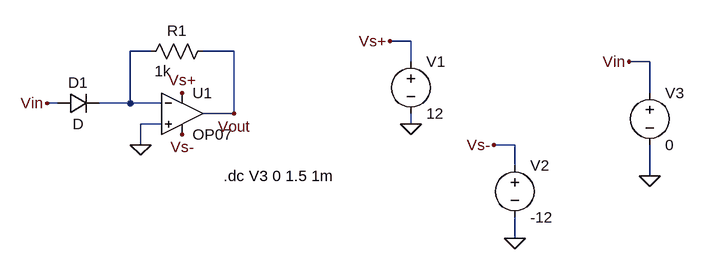
[diagram p0: schematic Task05 expo.asc]
Task05 expo.asc, the LTspice schematic file:
Version 4
SHEET 1 880 680
WIRE 192 -16 160 -16
WIRE -208 0 -240 0
WIRE -80 0 -128 0
WIRE 192 16 192 -16
WIRE 560 16 528 16
WIRE 560 64 560 16
WIRE -352 80 -368 80
WIRE -240 80 -240 0
WIRE -240 80 -288 80
WIRE -192 80 -240 80
WIRE -80 96 -80 0
WIRE -80 96 -128 96
WIRE -192 112 -224 112
WIRE 192 112 192 96
WIRE -224 144 -224 112
WIRE 352 144 320 144
WIRE 352 176 352 144
WIRE 560 192 560 144
WIRE 352 288 352 256
FLAG -224 144 0
FLAG -368 80 Vin
FLAG -160 64 Vs+
FLAG -160 128 Vs-
FLAG 192 112 0
FLAG 352 288 0
FLAG 160 -16 Vs+
FLAG 528 16 Vin
FLAG 320 144 Vs-
FLAG -80 96 Vout
FLAG 560 192 0
SYMBOL OpAmps\\OP07 -160 32 R0
SYMATTR InstName U1
SYMBOL voltage 192 0 R0
SYMATTR InstName V1
SYMATTR Value 12
SYMBOL voltage 352 160 R0
SYMATTR InstName V2
SYMATTR Value -12
SYMBOL voltage 560 48 R0
SYMATTR InstName V3
SYMATTR Value 0
SYMBOL diode -352 96 R270
WINDOW 0 32 32 VTop 2
WINDOW 3 0 32 VBottom 2
SYMATTR InstName D1
SYMBOL res -224 16 R270
WINDOW 0 32 56 VTop 2
WINDOW 3 1 34 VBottom 2
SYMATTR InstName R1
SYMATTR Value 1k
TEXT -96 192 Left 2 !.dc V3 0 1.5 1m

The netlist it stands for:
* Task05 expo.asc
XU1 0 N001 Vs+ Vs- Vout LT1001  ; OP07, pins In+ In- V+ V- OUT
V1 Vs+ 0 12
V2 Vs- 0 -12
V3 Vin 0 0
D1 Vin N001 D
R1 N001 Vout 1k
.model D D
.lib standard.dio
.dc V3 0 1.5 1m
.lib LTC.lib
.backanno
.end

* Results of the author's LTspice run, read from the files saved beside the schematic
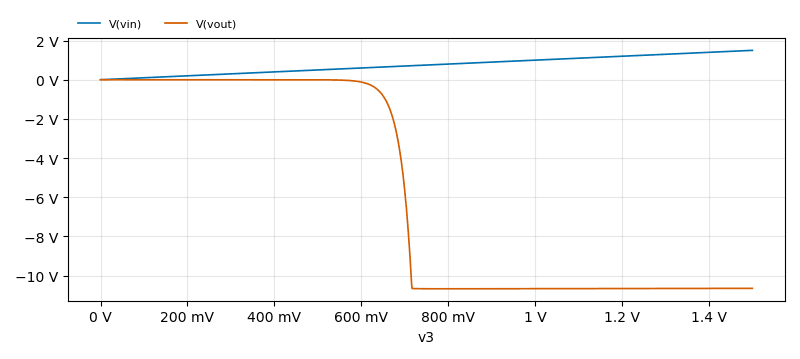
[diagram p1: DC transfer characteristic of Task05 expo.asc, plotted from the saved traces]
* DC transfer characteristic, 1 run:
*   V(vin): 0 V at v3=0 V, 1.5 V at v3=1.5 V, min 0 V, max 1.5 V
*   V(vout): -0.002472 fV at v3=0 V, -10.66 V at v3=1.5 V, min -10.68 V, max -0.002472 fV